# EAGLE schematic lm3414-rgb-ca-led-driver-mk-1.0 (EAGLE 6.5.0)
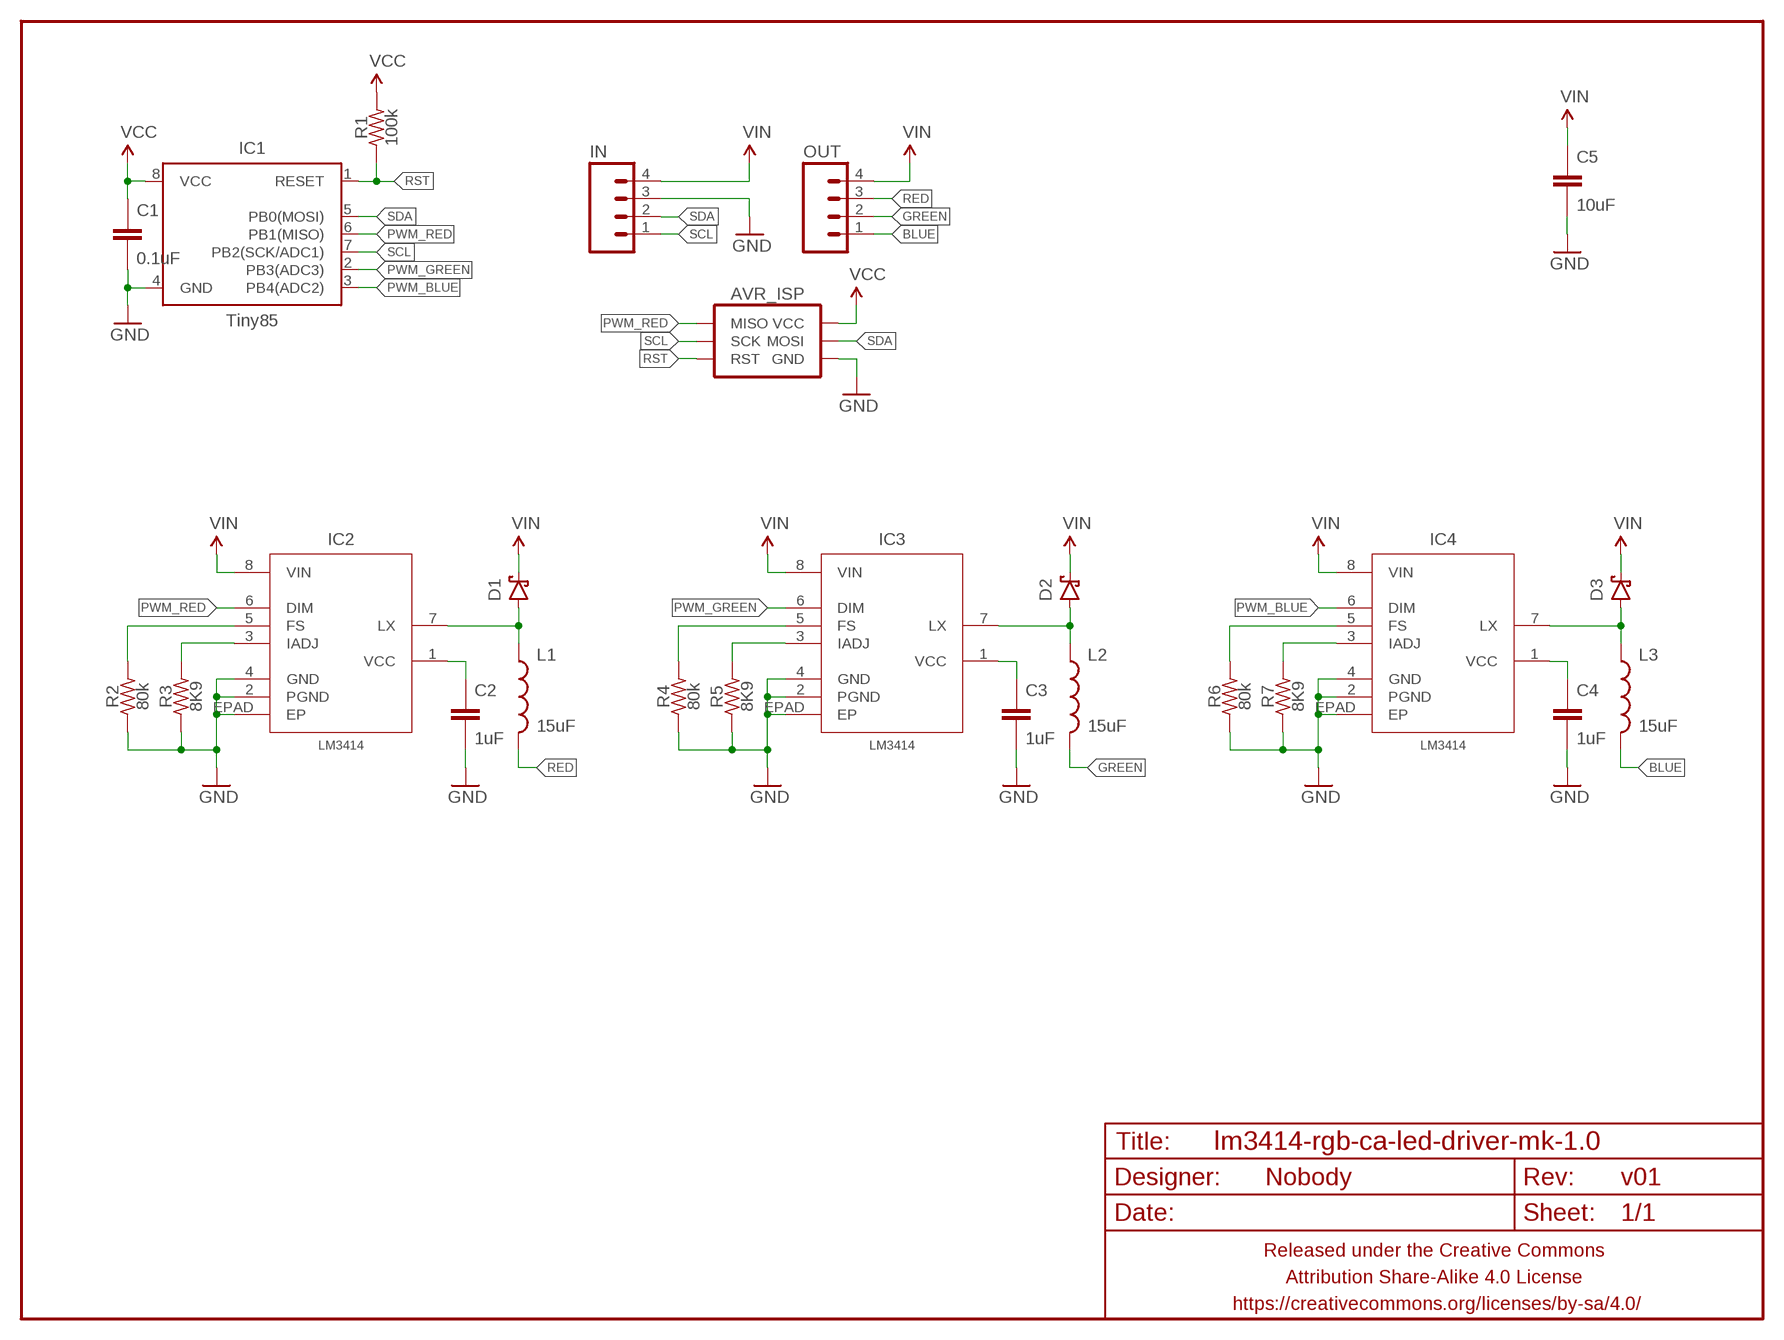
[diagram p0: schematic, sheet 1]

## Parts
AVR_ISP  AVR_SPI_PRG_6TESTPOINTS  [2X3_TEST_POINTS]
C1  0.1uF  CAPACITOR-CERAMICC0603  [C0603]
C2  1uF  CAPACITOR-CERAMICC0603  [C0603]
C3  1uF  CAPACITOR-CERAMICC0603  [C0603]
C4  1uF  CAPACITOR-CERAMICC0603  [C0603]
C5  10uF  CAPACITOR-CERAMICC1206  [C1206]
D1  DIODE-SCHOTTKYSMA  [SMA-DIODE-SCHOTTKY]
D2  DIODE-SCHOTTKYSMA  [SMA-DIODE-SCHOTTKY]
D3  DIODE-SCHOTTKYSMA  [SMA-DIODE-SCHOTTKY]
FRAME1  FRAME-LETTERNO_PACKAGE  [DUMMY]
IC1  Tiny85  ATTINY45TINY85-20-SOICW  [SO08-EIAJ]
IC2  LM3414  LM3414SO08-PAD  [SO08-PAD]
IC3  LM3414  LM3414SO08-PAD  [SO08-PAD]
IC4  LM3414  LM3414SO08-PAD  [SO08-PAD]
IN  M04PTH  [1X04-PTH-VERT]
L1  15uF  INDUCTOR-TAIYO-YUDEN-6X2.8  [TAIYO-YUDEN-6X6X2.8]
L2  15uF  INDUCTOR-TAIYO-YUDEN-6X2.8  [TAIYO-YUDEN-6X6X2.8]
L3  15uF  INDUCTOR-TAIYO-YUDEN-6X2.8  [TAIYO-YUDEN-6X6X2.8]
OUT  M04PTH  [1X04-PTH-VERT]
R1  100k  RESISTORR0603  [R0603]
R2  80k  RESISTORR0603  [R0603]
R3  8K9  RESISTORR0603  [R0603]
R4  80k  RESISTORR0603  [R0603]
R5  8K9  RESISTORR0603  [R0603]
R6  80k  RESISTORR0603  [R0603]
R7  8K9  RESISTORR0603  [R0603]

## Nets
BLUE: L3.2 OUT.1
GND: AVR_ISP.6(GND) C1.2 C2.2 C3.2 C4.2 C5.2 IC1.4(GND) IC2.2(PGND) IC2.4(GND) IC2.EPAD(EP) IC3.2(PGND) IC3.4(GND) IC3.EPAD(EP) IC4.2(PGND) IC4.4(GND) IC4.EPAD(EP) IN.3 R2.1 R3.1 R4.1 R5.1 R6.1 R7.1
GREEN: L2.2 OUT.2
N$1: IC2.3(IADJ) R3.2
N$2: IC2.5(FS) R2.2
N$3: IC3.3(IADJ) R5.2
N$4: C2.1 IC2.1(VCC)
N$5: IC3.5(FS) R4.2
N$6: D1.A IC2.7(LX) L1.1
N$7: C3.1 IC3.1(VCC)
N$8: D2.A IC3.7(LX) L2.1
N$9: IC4.3(IADJ) R7.2
N$10: IC4.5(FS) R6.2
N$11: C4.1 IC4.1(VCC)
N$12: D3.A IC4.7(LX) L3.1
PWM_BLUE: IC1.3(PB4(ADC2)) IC4.6(DIM)
PWM_GREEN: IC1.2(PB3(ADC3)) IC3.6(DIM)
PWM_RED: AVR_ISP.1(MISO) IC1.6(PB1(MISO)) IC2.6(DIM)
RED: L1.2 OUT.3
RST: AVR_ISP.5(RST) IC1.1(RESET) R1.1
SCL: AVR_ISP.3(SCK) IC1.7(PB2(SCK/ADC1)) IN.1
SDA: AVR_ISP.4(MOSI) IC1.5(PB0(MOSI)) IN.2
VCC: AVR_ISP.2(VCC) C1.1 IC1.8(VCC) R1.2
VIN: C5.1 D1.C D2.C D3.C IC2.8(VIN) IC3.8(VIN) IC4.8(VIN) IN.4 OUT.4

## Library data of the parts
AVR_ISP = A_butts:AVR_SPI_PRG_6: AVR ISP 6 Pin This is the reduced ISP connector for AVR programming. Common on Arduino. This footprint will take up less PCB space and can be used with a 10-pin to 6-pin adapter such as SKU: BOB-08508 **Special note about "TEST_POINT" package. The stop mask is on the top side, so if you want your programming test points to be on the bottom of your board, make sure to place this package on the bottom side of the board. This also ensure that the orientation to program from the bottom side will be correct.
C1-C5 = A_butts:CAPACITOR-CERAMIC: CAPACITOR, European symbol
D1-D3 = A_butts:DIODE-SCHOTTKY: Schottky diodes in SFE's production catalog BAT20J 1A 23V 0.62Vf RB751 120mA 40V 0.37Vf PMEG4005EJ 0.5A 40V 0.42Vf MBRA140 1A 40V 0.5Vf B340A 3A 40V SMA
FRAME1 = A_butts:FRAME-LETTER: Schematic Frame Standard 8.5x11 US Letter frame; DESIGNER: Nobody; VERSION: v01
IC1 = A_butts:ATTINY45: Atmel 8-pin 2/4/8kB flash uC; PROD_ID: IC-09092; VALUE: Tiny85-20-SMT
IC2-IC4 = A_butts:LM3414
IN OUT = A_butts:M04: Header 4 Standard 4-pin 0.1" header. Use with straight break away headers (SKU : PRT-00116), right angle break away headers (PRT-00553), swiss pins (PRT-00743), machine pins (PRT-00117), and female headers (PRT-00115). Molex polarized connector foot print use with SKU : PRT-08231 with associated crimp pins and housings. 1MM SMD Version SKU: PRT-10208
L1-L3 = A_butts:INDUCTOR: Inductors Basic Inductor/Choke - 0603 and 1206. Footprints are not proven and vary greatly between part numbers. SRN6045- 33uH, 20% 1.4A SDR0403-560KL - 56uH, 10%, 500mA RMS/740mA peak
R1-R7 = A_butts:RESISTOR: RESISTOR, American symbol